# Altium project RGB_LED_STRIP_BOARD.PrjPcb
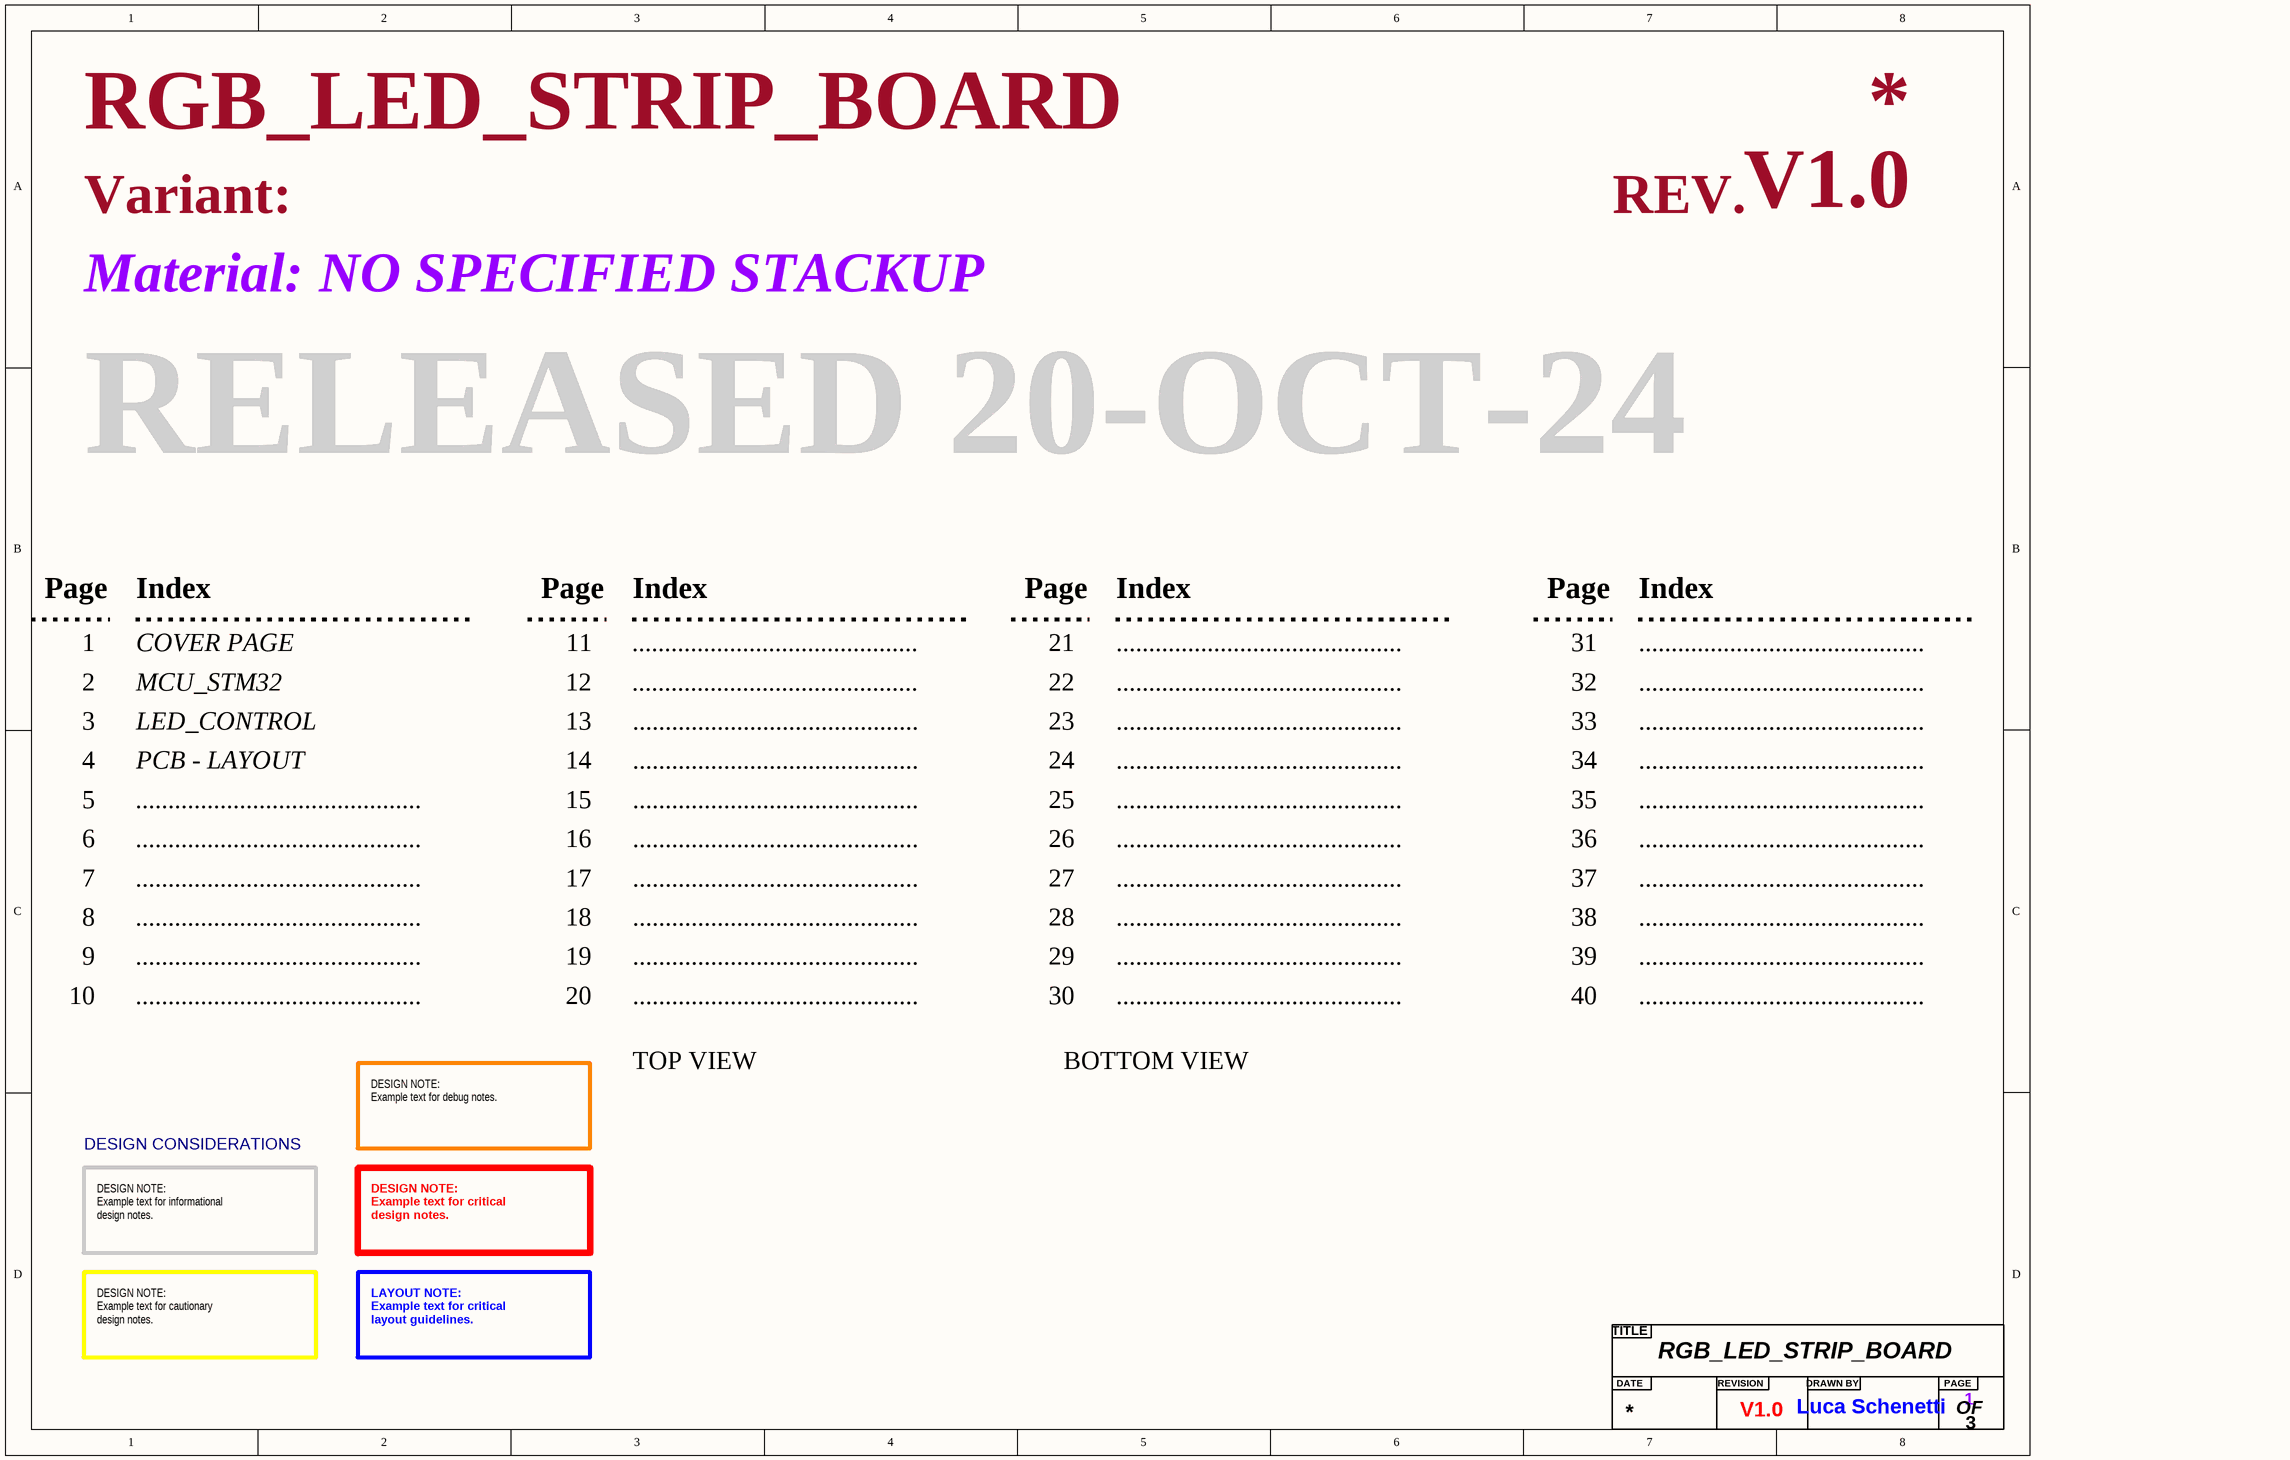
[diagram p0: COVER PAGE.SchDoc]
3 sheets, 70 parts. Net scope: flat (ports and power ports of the same name join across sheets).
Board file: PCB - LAYOUT.PcbDoc
Sheets:
  COVER PAGE.SchDoc
  MCU_STM32.SchDoc
  LED_CONTROL.SchDoc

## Sheet COVER PAGE.SchDoc: RGB_LED_STRIP_BOARD
size A3; Author: Luca Schenetti; DrawnBy: Luca Schenetti; Engineer: Luca Schenetti; Revision: V1.0; SheetNumber: 1; SheetTotal: 3; Material: NO SPECIFIED STACKUP

### Parts
(Parts that share a designator on the sheet are numbered #1, #2 ... from top to bottom, then left to right.)
?#1  Title  (value not drawn)  (graphical)

### Notes on the sheet
- Variant:
- REV.
- Material:
- RELEASED 20-OCT-24
- Page
- Index
- 1
- 2
- COVER PAGE
- MCU_STM32
- 11
- 12
- ............................................
- 21
- 22
- 31
- 32
- 3
- LED_CONTROL
- 13
- 23
- 33
- 4
- 5
- PCB - LAYOUT
- 14
- 15
- 24
- 25
- 34
- 35
- 6
- 7
- 16
- 17
- 26
- 27
- 36
- 37
- 8
- 18
- 28
- 38
- 9
- 10
- 19
- 20
- 29
- 30
- 39
- 40
- TOP VIEW
- BOTTOM VIEW
- DESIGN CONSIDERATIONS
- DESIGN NOTE:
  Example text for debug notes.
- DESIGN NOTE:
  Example text for informational
  design notes.
- DESIGN NOTE:
  Example text for critical
  design notes.
- DESIGN NOTE:
  Example text for cautionary
  design notes.
- LAYOUT NOTE:
  Example text for critical
  layout guidelines.
- (in symbol Title) TITLE; DATE; REVISION; DRAWN BY; PAGE; OF

## Sheet MCU_STM32.SchDoc: RGB_LED_STRIP_CONTROL_BOARD
size A3; Author: Luca Schenetti; DrawnBy: Luca Schenetti; Engineer: Luca Schenetti; Revision: V1.0; SheetNumber: 2; SheetTotal: 2
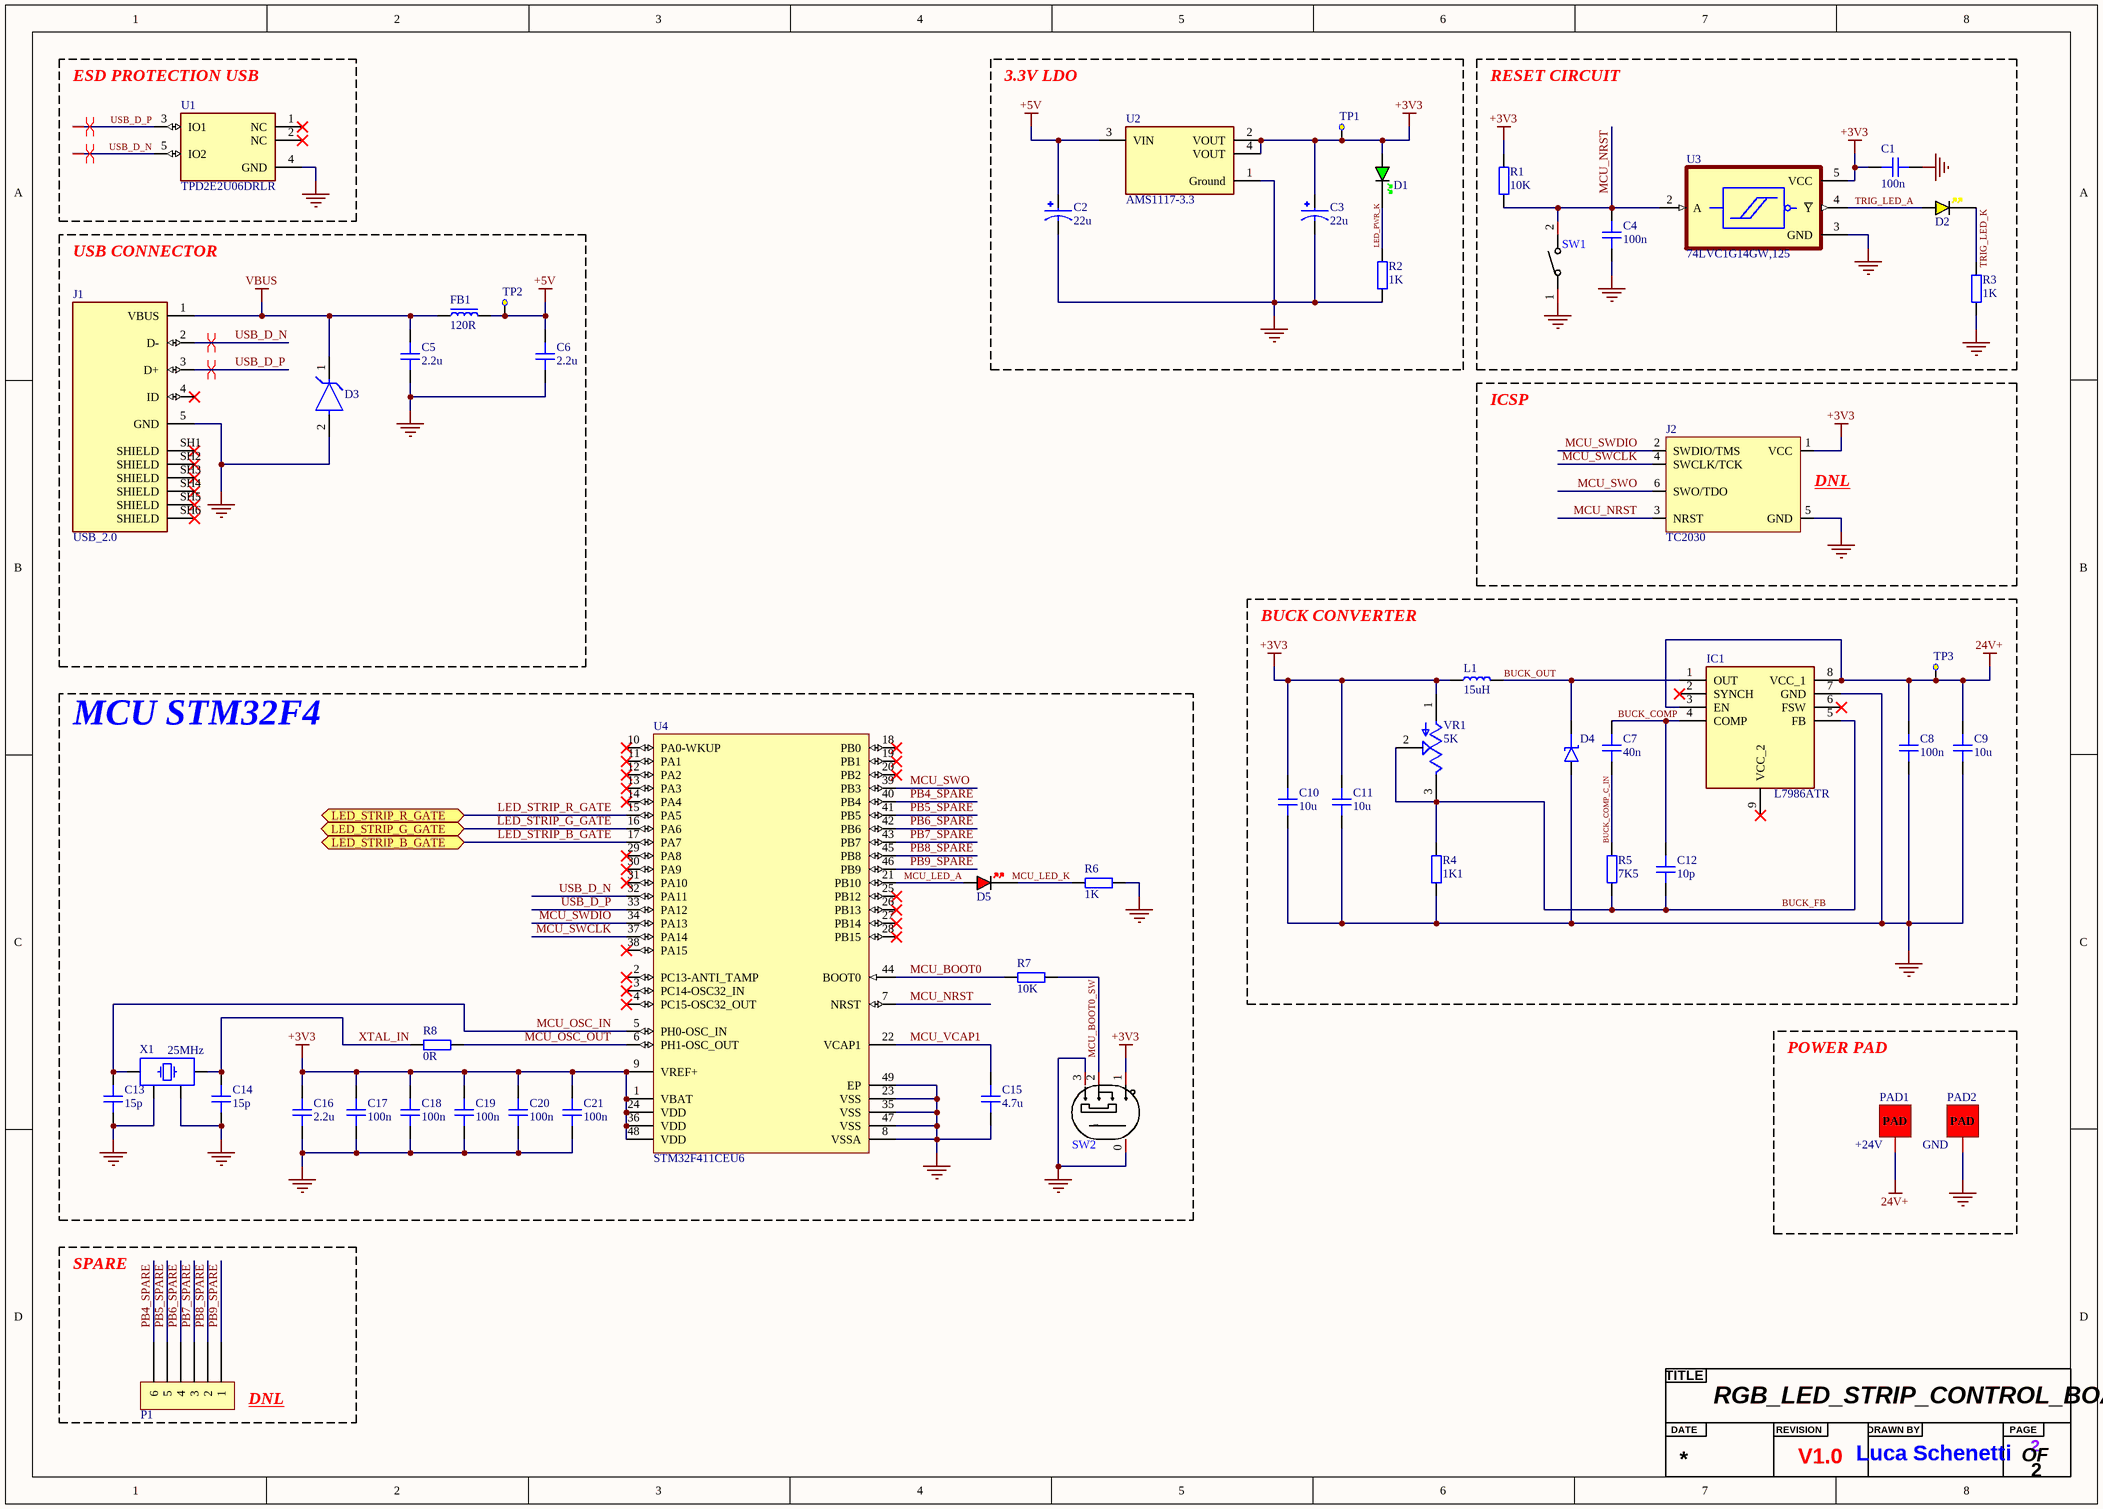
[diagram p1: MCU_STM32.SchDoc]

### Parts
(Parts that share a designator on the sheet are numbered #1, #2 ... from top to bottom, then left to right.)
?#2  Title  (value not drawn)  (graphical)
C1  100n  [CAP_0402]
C2  22u  [CAP_EEE1EA220WR]
C3  22u  [CAP_EEE1EA220WR]
C4  100n  [CAP_0402]
C5  2.2u  [CAP_0603]
C6  2.2u  [CAP_0603]
C7  40n  [CAP_0805]
C8  100n  [CAP_0805]
C9  10u  [CAP_0805]
C10  10u  [CAP_0805]
C11  10u  [CAP_0805]
C12  10p  [CAP_0402]
C13  15p  [CAP_0402]
C14  15p  [CAP_0402]
C15  4.7u  [CAP_0603]
C16  2.2u  [CAP_0603]
C17  100n  [CAP_0402]
C18  100n  [CAP_0402]
C19  100n  [CAP_0402]
C20  100n  [CAP_0402]
C21  100n  [CAP_0402]
D1  GREEN  [LED_0603_GREEN]  (value not drawn)
D2  YELLOW  [LED_0603_YELLOW]  (value not drawn)
D3  SMAJ5.0A  [FP-SMA-MFG]  (value not drawn)
D4  (no value)  [DO-214AC-2 (SMA)]
D5  RED  [LED_0603_RED]  (value not drawn)
FB1  120R  [FB_0603]
IC1  L7986ATR  [SOIC127P600X170-9N]
J1  USB_2.0  [USB_2.0]
J2  TC2030  [TC2030-FP]  (no BOM)
L1  15uH  [FXL0630-150-M]
P1  (no value)  [Header 1x6 male]
PAD1  +24V  [PAD_PWR]
PAD2  GND  [PAD_PWR]
R1  10K  [RES_0402]
R2  1K  [RES_0402]
R3  1K  [RES_0402]
R4  1K1  [RES_0603]
R5  7K5  [RES_0603]
R6  1K  [RES_0402]
R7  10K  [RES_0402]
R8  0R  [RES_0402]
SW1  TS-1088-AR02016  [TS-1088-AR02016]  (value not drawn)
SW2  SK-3296S-01-L1  [SW-SMD_3P-P1.50_L2.7-W6.6]  (value not drawn)
TP1  Test Point  [Test Point]  (value not drawn)
TP2  Test Point  [Test Point]  (value not drawn)
TP3  Test Point  [Test Point]  (value not drawn)
U1  TPD2E2U06DRLR  [FP-DRL0005A-MFG]
U2  AMS1117-3.3  [FP-AMS1117-IPC_C]
U3  74LVC1G14GW,125  [SOT65P212X110-5N]
U4  STM32F411CEU6  [STM-UFQFPN48_L]
VR1  5K  [TRIM_3362P-1-502LF]
X1  25MHz  [XTAL_3225]

### Blocks framed on the sheet
ESD PROTECTION USB: U1
3.3V LDO: C2 C3 D1 R2 TP1 U2
RESET CIRCUIT: C1 C4 D2 R1 R3 SW1 U3
USB CONNECTOR: C5 C6 D3 FB1 J1 TP2
BUCK CONVERTER: C7-C12 D4 IC1 L1 R4 R5 TP3 VR1
MCU STM32F4: C13-C21 D5 R6-R8 SW2 U4 X1
POWER PAD: PAD1 PAD2

### Ports
LED_STRIP_B_GATE (bidir, see LED_CONTROL[2A]), LED_STRIP_G_GATE (bidir, see LED_CONTROL[1A]), LED_STRIP_R_GATE (bidir, see LED_CONTROL[1B])

### Nets
24V+: C8.2 C9.2 IC1.3(EN) IC1.8(VCC_1) PAD1.1(PAD) TP3.1(Test_Point)
+3V3: C1.2 C3.1 C10.2 C11.2 C16.2 C17.2 C18.2 C19.2 C20.2 C21.2 D1.A J2.1(VCC) L1.1 R1.2 SW2.1 TP1.1(Test_Point) U2.2(VOUT) U2.4(VOUT) U3.5(VCC) U4.1(VBAT) U4.9(VREF+) U4.24(VDD) U4.36(VDD) U4.48(VDD) VR1.1(CCW)
+5V: C2.1 C6.2 FB1.2 TP2.1(Test_Point) U2.3(VIN)
GND: C1.1 C2.2 C3.2 C4.1 C5.1 C6.1 C8.1 C9.1 C10.1 C11.1 C13.1 C14.1 C15.1 C16.1 C17.1 C18.1 C19.1 C20.1 C21.1 D3.2(A) D4.A IC1.7(GND) J1.5(GND) J2.5(GND) PAD2.1(PAD) R2.1 R3.1 R4.1 R6.1 SW1.1 SW2.0 SW2.3 U1.4(GND) U2.1(Ground) U3.3(GND) U4.8(VSSA) U4.23(VSS) U4.35(VSS) U4.47(VSS) U4.49(EP) X1.2 X1.4
VBUS: C5.2 D3.1(C) FB1.1 J1.1(VBUS)
BUCK_COMP: C7.2 C12.2 IC1.4(COMP)
BUCK_COMP_C_IN: C7.1 R5.2
BUCK_FB: C12.1 IC1.5(FB) R4.2 R5.1 VR1.2(WIPER) VR1.3(CW)
BUCK_OUT: D4.K IC1.1(OUT) L1.2
LED_PWR_K: D1.K R2.2
LED_STRIP_B_GATE: U4.17(PA7) ; port LED_STRIP_B_GATE
LED_STRIP_G_GATE: U4.16(PA6) ; port LED_STRIP_G_GATE
LED_STRIP_R_GATE: U4.15(PA5) ; port LED_STRIP_R_GATE
MCU_BOOT0: R7.2 U4.44(BOOT0)
MCU_BOOT0_SW: R7.1 SW2.2
MCU_LED_A: D5.A U4.21(PB10)
MCU_LED_K: D5.K R6.2
MCU_NRST: C4.2 J2.3(NRST) R1.1 SW1.2 U3.2(A) U4.7(NRST)
MCU_OSC_IN: C13.2 U4.5(PH0-OSC_IN) X1.1
MCU_OSC_OUT: R8.1 U4.6(PH1-OSC_OUT)
MCU_SWCLK: J2.4(SWCLK/TCK) U4.37(PA14)
MCU_SWDIO: J2.2(SWDIO/TMS) U4.34(PA13)
MCU_SWO: J2.6(SWO/TDO) U4.39(PB3)
MCU_VCAP1: C15.2 U4.22(VCAP1)
PB4_SPARE: P1.6 U4.40(PB4)
PB5_SPARE: P1.5 U4.41(PB5)
PB6_SPARE: P1.4 U4.42(PB6)
PB7_SPARE: P1.3 U4.43(PB7)
PB8_SPARE: P1.2 U4.45(PB8)
PB9_SPARE: P1.1 U4.46(PB9)
TRIG_LED_A: D2.A U3.4(~{Y})
TRIG_LED_K: D2.K R3.2
USB_D_N: J1.2(D-) U1.5(IO2) U4.32(PA11)
USB_D_P: J1.3(D+) U1.3(IO1) U4.33(PA12)
XTAL_IN: C14.2 R8.2 X1.3

Not connected (* = marked no-connect by the designer): IC1 2(SYNCH)* 6(FSW)* 9(VCC_2)*; J1 4(ID)* SH1(SHIELD)* SH2(SHIELD)* SH3(SHIELD)* SH4(SHIELD)* SH5(SHIELD)* SH6(SHIELD)*; U1 1(NC)* 2(NC)*; U4 2(PC13-ANTI_TAMP)* 3(PC14-OSC32_IN)* 4(PC15-OSC32_OUT)* 10(PA0-WKUP)* 11(PA1)* 12(PA2)* 13(PA3)* 14(PA4)* 18(PB0)* 19(PB1)* 20(PB2)* 25(PB12)* 26(PB13)* 27(PB14)* 28(PB15)* 29(PA8)* 30(PA9)* 31(PA10)* 38(PA15)*

### Layout directives
differential pair; differential pair class DIFF_USB: USB_D_N, USB_D_P

### Notes on the sheet
- ICSP
- (near J2) DNL
- SPARE
- (near P1) DNL
- (in symbol Title) TITLE; DATE; REVISION; DRAWN BY; PAGE; OF

### Library data of the parts
C1 C4 C17-C21 = CAP_0402: Capacitor SMD 0402 [C1525]; Manufacturer: *; Manufacturer Part Number: *; Distributor Link: *; LCSC: *; Rating: *; Dielectric: *
C2 C3 = EEE1EA220WR: Cap Aluminum Lytic 22uF [C2887274]; MF: Panasonic; Value: 35V 22uF; Digi-Key_Part_Number: PCE3900TR-ND; SnapEDA_Link: https://www.snapeda.com/parts/EEE1EA220WR/Panasonic/view-part/?ref=snap; Purchase-URL: https://pricing.snapeda.com/search/part/EEE1EA220WR/?ref=eda; Package: RADIAL-2 Panasonic; MP: C2887274; Check_prices: https://www.snapeda.com/parts/EEE1EA220WR/Panasonic/view-part/?ref=eda
C5 C6 C16 = CAP_0603: Capacitor SMD 0603 [C23630]; Manufacturer: *; Manufacturer Part Number: *; Distributor Link: *; LCSC: *; Rating: *; Dielectric: *
C7 = CAP_0805: Capacitor SMD 0805 [C502151]; Manufacturer: *; Manufacturer Part Number: *; Distributor Link: *; LCSC: *; Rating: *; Dielectric: *
C8 = CAP_0805: Capacitor SMD [C49678]; Manufacturer: *; Manufacturer Part Number: *; Distributor Link: *; LCSC: *; Rating: *; Dielectric: *
C9-C11 = CAP_0805: Capacitor SMD [C440198]; Manufacturer: *; Manufacturer Part Number: *; Distributor Link: *; LCSC: *; Rating: *; Dielectric: *
C12 = CAP_0402: Capacitor SMD 0402 [C32949]; Manufacturer: *; Manufacturer Part Number: *; Distributor Link: *; LCSC: *; Rating: *; Dielectric: *
C13 C14 = CAP_0402: Capacitor SMD 0402 [C1548]; Manufacturer: *; Manufacturer Part Number: *; Distributor Link: *; LCSC: *; Rating: *; Dielectric: *
C15 = CAP_0603: Capacitor SMD 0603 [C19666]; Manufacturer: *; Manufacturer Part Number: *; Distributor Link: *; LCSC: *; Rating: *; Dielectric: *
D1 = LED_0603_GREEN: LED 0603 GREEN SMD[C2986059]
D2 = LED_0603_YELLOW: LED 0603 YELLOW SMD[C72038]
D3 = CMP-12828-000007-1: TVS DIODE 5V 9.2V SMA[C2925443]; Manufacturer: Diodes Inc.; Manufacturer Part Number: SMAJ5.0A-13-F; Peak Pulse Power: 400W; Number Of Channels: 1; Max Junction Temp: +150°C; Peak Pulse Current: 43.5A; Breakdown Voltage: 6.4V; Direction: Unidirectional; Standoff Height: 0.05mm; Device Class L3: unset; Mouser Description: TVS DIODE 5V 9.2V SMA; Device Class L1: Circuit Protection; Temperature Range High: +150°C; Category: Diode; ComponentLink2Description: Datasheet; Temperature Range Low: -55°C; Device Class L2: TVS Diodes; RoHS: TRUE; Automotive: No; Footprint Url: https://www.diodes.com/assets/Package-Files/SMA.pdf; Reverse Standoff Voltage: 5V; Clamping Voltage: 9.2V; Temperature: -55°C to +150°C; Height: 2.4mm; Octopart: https://octopart.com/smaj5.0a-13-f-diodes+inc.-350158; Lead Free: Yes; Digikey Description: TVS DIODE 5V 9.2V SMA; Package: SMA; ComponentLink2URL: https://www.diodes.com/assets/Datasheets/ds19005.pdf
D4 = D_SCHOTTKY_SMA: Diode Schottky SMD SMA (DO-214AA)[C8678]
D5 = LED_0603_RED: LED 0603 RED SMD[C2926776]
FB1 = FB_0603: Ferrite Bead SMD 0603[C14709]; Manufacturer: *; Manufacturer Part Number: *; Distributor Link: *; LCSC: *
IC1 = L7986ATR: Integrated Circuit; Manufacturer_Name: STMicroelectronics; Datasheet Link: https://www.st.com/resource/en/datasheet/l7986.pdf; Height: 1.7mm; Manufacturer_Part_Number: L7986ATR; Mouser Part Number: 511-L7986ATR; Mouser Price/Stock: https://www.mouser.co.uk/ProductDetail/STMicroelectronics/L7986ATR?qs=T%2FOtf55vL7eudqXxvIAS9A%3D%3D; Arrow Part Number: L7986ATR; Arrow Price/Stock: https://www.arrow.com/en/products/l7986atr/stmicroelectronics?region=nac
J1 = USB_2.0: [C132563]
J2 = TC2030: Tag-Connect No-Solder SWD Debug Connector DO NOT PLACE; Manufacturer: Tag-Connect; Manufacturer Part Number: TC2030
L1 = FXL0630-150-M: Power Inductor SMD [C177243]; Manufacturer: cjiang (Changjiang Microelectronics Tech); Manufacturer Part Number: FXL0630-150-M
P1 = Header 1x6: [C37208]
PAD1 PAD2 = PAD_PWR
R1 R7 = RES_0402: Resistor SMD 0402 [C25744]; Manufacturer: *; Manufacturer Part Number: *; Distributor Link: *; LCSC: *
R2 R3 R6 = RES_0402: Resistor SMD 0402 [C11702]; Manufacturer: *; Manufacturer Part Number: *; Distributor Link: *; LCSC: *
R4 = RES_0603: Resistor SMD 0603[C22764]; Manufacturer: *; Manufacturer Part Number: *; Distributor Link: *; LCSC: *
R5 = RES_0603: Resistor SMD 0603[C23234]; Manufacturer: *; Manufacturer Part Number: *; Distributor Link: *; LCSC: *
R8 = RES_0402: Resistor SMD 0402 [C17168]; Manufacturer: *; Manufacturer Part Number: *; Distributor Link: *; LCSC: *
SW1 = TS-1088-AR02016: Manufacturer: XUNPU(讯普); Add into BOM: yes; Circuit: SPST; Actuator Style: Round Button; Operating Force: 160gf; Switch Length: 4mm; Switch Width: 3mm; Switch Height: 2mm; Strike Gundam: 不带; Contact Current: 50mA; Voltage Rating (DC): 12V; Insulation Resistance: 100MΩ; Actuator/Cap Color: Black; Pin Style: SMDSplicing; Mechanical Life: 10万次; Symbol: TS-1088-AR02016; Device: TS-1088-AR02016; Supplier: LCSC; Supplier Part: C720477; Manufacturer Part: TS-1088-AR02016; JLCPCB Part Class: Extended Part; LCSC Part Name: 4*3*2mm 立贴 轻触开关; Supplier Footprint: SMD; Datasheet: https://atta.szlcsc.com/upload/public/pdf/source/20200810/C720475_60D09DD6C54279ADDB2DC25100F1CC11.pdf; Convert to PCB: yes; Mounting Style: Brick nogging; Operating Temperature: -30℃~+80℃
SW2 = SK-3296S-01-L1: Manufacturer: XKB Connectivity(中国星坤); Add into BOM: yes; Circuit: SPDT; Actuator Style: Rectangular columnar; Pin Style: SMDSplicing; Switch Length: 7.8mm; Switch Width: 2.75mm; Switch Height: 1.35mm; Actuator Color: Black; Current Rating (DC): 50mA; Voltage Rating (DC): 12V; Mechanical Life: 1万次; Symbol: SK-3296S-01-L1; Device: SK-3296S-01-L1; LCSC Part Name: 柄长1.5mm 卧贴双档 滑动开关; Supplier Part: C319020; Manufacturer Part: SK-3296S-01-L1; Supplier Footprint: SMD; JLCPCB Part Class: Extended Part; Datasheet: https://atta.szlcsc.com/upload/public/pdf/source/20211011/33977E7F5E3AE40A3E3DC6795807E20F.pdf; Supplier: LCSC; Convert to PCB: yes; Mounting Style: 卧贴; Current Rating (AC): 50mA; Voltage Rating (AC): 12V; Operating Temperature: -40℃~+85℃
U1 = CMP-04985-000005-1: TVS DIODE 5.5V 12.4V SOT5[C1855726]; Manufacturer: Texas Instruments; Standoff Height: 0mm; Interface: USB,Ethernet,LVDS,Other; Peak Pulse Current: 5.5A; Number Of Channels: 2; Clamping Voltage: 9.7V; Peak Pulse Power: 85W; Breakdown Voltage: 6.5V; Direction: Unidirectional; Digikey Description: TVS DIODE 5.5V 12.4V SOT5; Footprint Url: http://www.ti.com/lit/ds/symlink/sn74ahct1g08.pdf; ComponentLink2URL: http://www.ti.com/lit/ds/symlink/tpd2e2u06.pdf; Ambient Temperature Range Low: -40°C; Temperature: -40°C to +125°C; Temperature Range Low: -40°C; Lead Free: Yes; Automotive: No; Octopart: https://octopart.com/tpd2e2u06drlr-texas+instruments-47095345; Ambient Temperature Range High: +125°C; Height: 0.6mm; RoHS: TRUE; Category: IC; Package: DRL0005A; Device Class L1: Circuit Protection; Temperature Range High: +125°C; Manufacturer Part Number: TPD2E2U06DRLR; Device Class L2: ESD and Circuit Protection ICs; Ipc Land Pattern Name: SOTFL50P160X55-6; ComponentLink2Description: Datasheet; Mouser Description: ESD Suppressors Dual-Ch High-Speed ESD Protection; Reverse Standoff Voltage: 5.5V; Device Class L3: unset
U2 = CMP-209535-000001-1: LDO Voltage Regulators 1A, 3.3V [C6186]; Manufacturer: Advanced Monolithic Systems; Dropout Voltage: 1.1V; Output Type: Fixed; Nominal Supply Current: 5mA; Max Power Dissipation: 1.2W; Max Supply Voltage: 15V; Number Of Outputs: 1; Standoff Height: 0.64mm; Max Junction Temp: +125°C; Height: 1.8mm; Package: AMS1117; Device Class L2: Power Management ICs; ComponentLink2Description: Datasheet; ComponentLink2URL: http://www.advanced-monolithic.com/pdf/ds1117.pdf; Category: IC; RoHS: TRUE; Automotive: No; Device Class L1: Integrated Circuits (ICs); Output Current: 1A; Device Class L3: Voltage Regulators - Linear; Temperature: -40°C to +125°C; Output Voltage: 3.3V; Manufacturer Part Number: AMS1117-3.3; Temperature Range Low: -40°C; Octopart: https://octopart.com/ams1117-3.3-advanced+monolithic+systems-25899300; Lead Free: Yes; Ipc Land Pattern Name: SOT229P700X180-4; Temperature Range High: +125°C
U3 = 74LVC1G14GW,125: Inverter Schmitt Trigger 1-Element CMOS 5-Pin TSSOP T/R; Price: None; Availability: Unavailable; MP: 74LVC1G14GW,125; Value: *; Package: None
U4 = CMP-0243-00165-1: ARM Cortex-M4 32-bit MCU+FPU, 512 KB Flash, 128 KB RAM, 36 I/Os, 48-Pin UFQFPN, -40 to 85 degC, Tray[ / STM32F411CEU6]; Operating Frequency(F) (Processor speed) (MHz): 100; FLASH Size (Prog) (kB): 512; Internal RAM Size (kB): 128; Packing: Tray; I/Os (High Current): 36; Supply Voltage(Vcc) min (V): 1.7; Package Reference: 48-Pin Ultra Thin Fine Pitch Quad Flat No-Lead, 7 x 7 x 0.6 mm Body, 0.5 mm Pitch, Exposed Pad; ComponentLink1Description: Manufacturer URL; ComponentLink1URL: http://www.st.com/; Package Description: UFQFPN48; Core: ARM Cortex-M4; ComponentLink2Description: Datasheet; ComponentLink2URL: http://www.st.com/st-web-ui/static/active/en/resource/technical/document/datasheet/DM00115249.pdf; DatasheetVersion: Rev. 6; Mounting Technology: Surface Mount
VR1 = 3362P-1-502LF: Trimmer, Cermet, Rest 5 Kilohms, PCB, 1 Turns, Pwr-Rtg 0.5 W, Tol 10% | Bourns 3362P-1-502LF; SnapEDA_Link: https://www.snapeda.com/parts/3362P-1-502LF/Bourns/view-part/?ref=snap; Package: 3362P-1 Bourns Inc.; Value: *; MF: Bourns; MP: 3362P-1-502LF; Check_prices: https://www.snapeda.com/parts/3362P-1-502LF/Bourns/view-part/?ref=eda
X1 = TSX-3225_24.0000MF15X-AC: Crystal SMD 24MHz 10PPM 7pF 3225 [C9006]; Manufacturer: Epson; Manufacturer Part Number: TSX-3225 24.0000MF15X-AC
TP1-TP3 = Test Point: Value: Test Point

## Sheet LED_CONTROL.SchDoc: RGB_LED_STRIP_CONTROL_BOARD
size A4; Author: Luca Schenetti; DrawnBy: Luca Schenetti; Engineer: Luca Schenetti; Revision: V1.0; SheetNumber: 2; SheetTotal: 2
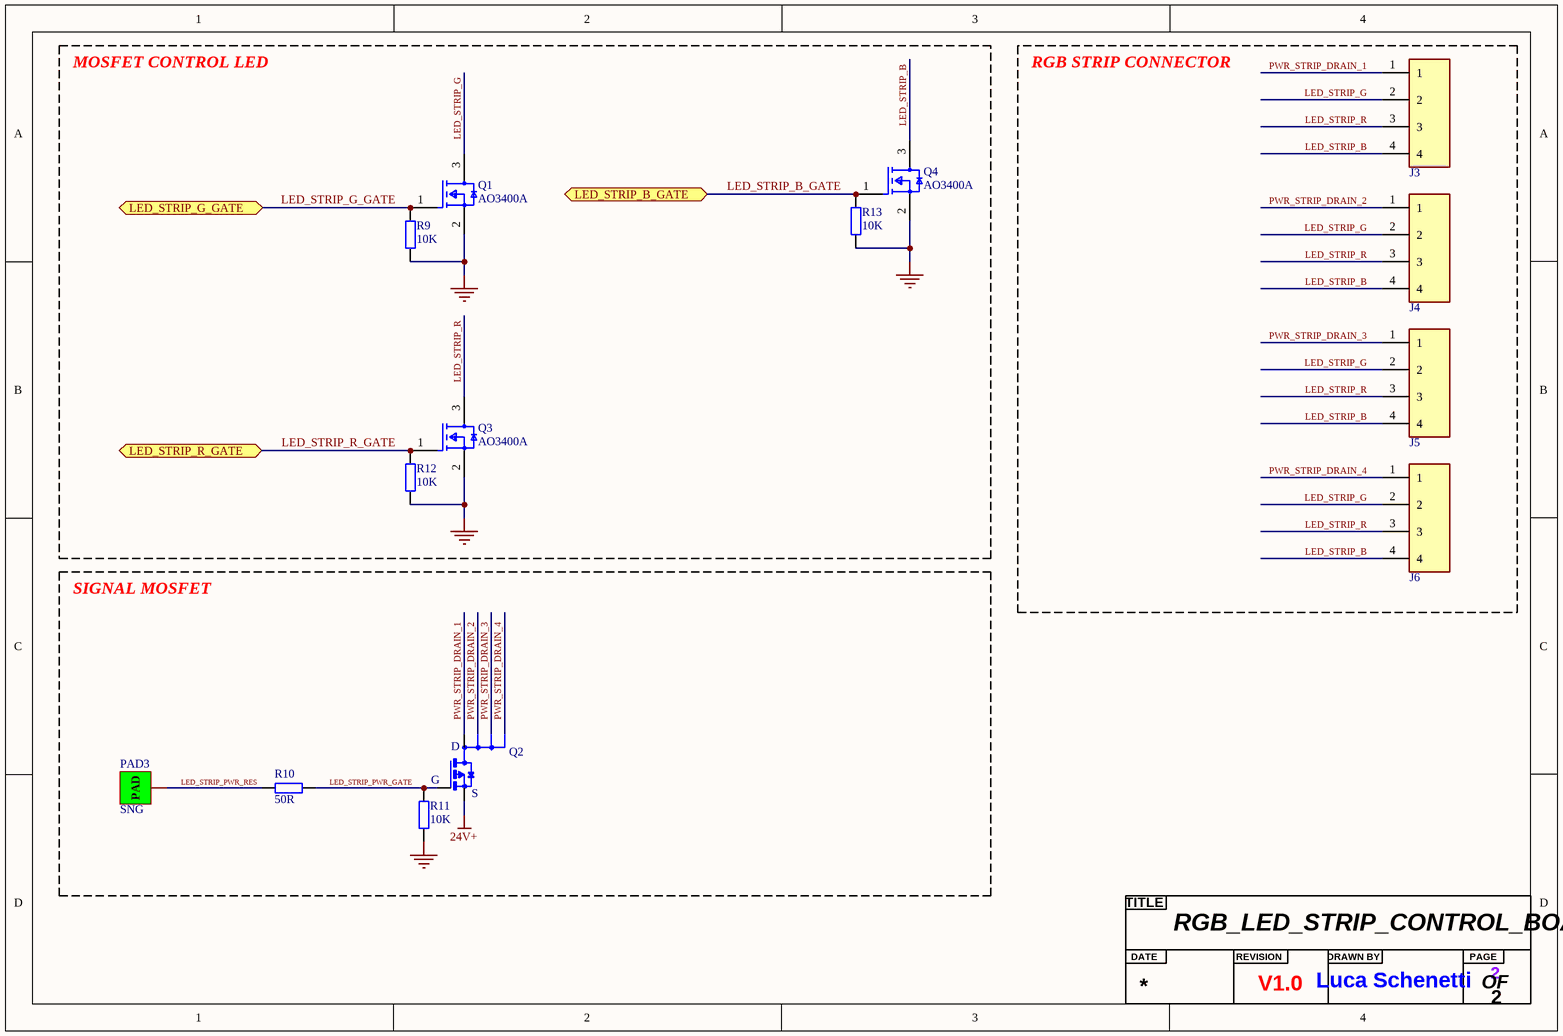
[diagram p2: LED_CONTROL.SchDoc]

### Parts
(Parts that share a designator on the sheet are numbered #1, #2 ... from top to bottom, then left to right.)
?#3  Title  (value not drawn)  (graphical)
J3  (no value)  [JST_PH_CONN]
J4  (no value)  [JST_PH_CONN]
J5  (no value)  [JST_PH_CONN]
J6  (no value)  [JST_PH_CONN]
PAD3  SNG  [PAD_SNG]
Q1  AO3400A  [FP-SOT23-MFG]
Q2  FDC610PZ  [FDC610PZ]  (value not drawn)
Q3  AO3400A  [FP-SOT23-MFG]
Q4  AO3400A  [FP-SOT23-MFG]
R9  10K  [RES_0402]
R10  50R  [RES_0603]
R11  10K  [RES_0402]
R12  10K  [RES_0402]
R13  10K  [RES_0402]

### Blocks framed on the sheet
MOSFET CONTROL LED: Q1 Q3 Q4 R9 R12 R13
RGB STRIP CONNECTOR: J3-J6
SIGNAL MOSFET: PAD3 Q2 R10 R11

### Ports
LED_STRIP_B_GATE (bidir, see MCU_STM32[2C]), LED_STRIP_G_GATE (bidir, see MCU_STM32[2C]), LED_STRIP_R_GATE (bidir, see MCU_STM32[2C])

### Nets
24V+: Q2.4(S)
GND: Q1.2(S) Q3.2(S) Q4.2(S) R9.1 R11.1 R12.1 R13.1
LED_STRIP_B: J3.4 J4.4 J5.4 J6.4 Q4.3(D)
LED_STRIP_B_GATE: Q4.1(G) R13.2 ; port LED_STRIP_B_GATE
LED_STRIP_G: J3.2 J4.2 J5.2 J6.2 Q1.3(D)
LED_STRIP_G_GATE: Q1.1(G) R9.2 ; port LED_STRIP_G_GATE
LED_STRIP_PWR_GATE: Q2.3(G) R10.2 R11.2
LED_STRIP_PWR_RES: PAD3.1(PAD) R10.1
LED_STRIP_R: J3.3 J4.3 J5.3 J6.3 Q3.3(D)
LED_STRIP_R_GATE: Q3.1(G) R12.2 ; port LED_STRIP_R_GATE
PWR_STRIP_DRAIN_1: J3.1 Q2.1(D1)
PWR_STRIP_DRAIN_2: J4.1 Q2.2(D2)
PWR_STRIP_DRAIN_3: J5.1 Q2.6(D3)
PWR_STRIP_DRAIN_4: J6.1 Q2.5(D4)

### Notes on the sheet
- (in symbol FDC610PZ) D
- (in symbol Title) TITLE; DATE; REVISION; DRAWN BY; PAGE; OF

### Library data of the parts
J3-J6 = JST_PH_CONN
PAD3 = PAD_SNG
Q1 Q3 Q4 = CMP-83955-000006-1: MOSFET N-CH 30V 5.7A SOT23 / [C20917]; Input Capacitance: 630pF; Number of Elements: 1; Rds On Max: 26.5mR; Max Power Dissipation: 1.4W; Gate to Source Voltage (Vgs): 12V; Min Operating Temperature: -55°C; Lead Free: Lead Free; Number of Pins: 3; Drain to Source Voltage (Vdss): 30V; Case/Package: SOT-23; Mount: Surface Mount; Continuous Drain Current (ID): 5.7A; Radiation Hardening: No; Packaging: Tape and Reel; Max Operating Temperature: 150°C; Power Dissipation: 1.4W
R9 R11-R13 = RES_0402: Resistor SMD 0402 [C25744]; Manufacturer: *; Manufacturer Part Number: *; Distributor Link: *; LCSC: *
R10 = RES_0603: Resistor SMD 0603[C849792]; Manufacturer: *; Manufacturer Part Number: *; Distributor Link: *; LCSC: *

## Nets that join several sheets
24V+: MCU_STM32 (6 pins), LED_CONTROL (Q2.4)
GND: MCU_STM32 (42 pins), LED_CONTROL (7 pins)
LED_STRIP_B_GATE: MCU_STM32 (U4.17), LED_CONTROL (Q4.1 R13.2)
LED_STRIP_G_GATE: MCU_STM32 (U4.16), LED_CONTROL (Q1.1 R9.2)
LED_STRIP_R_GATE: MCU_STM32 (U4.15), LED_CONTROL (Q3.1 R12.2)